# Altium schematic sheet MCU.SchDoc
size A; SheetNumber: 3; SheetTotal: 5
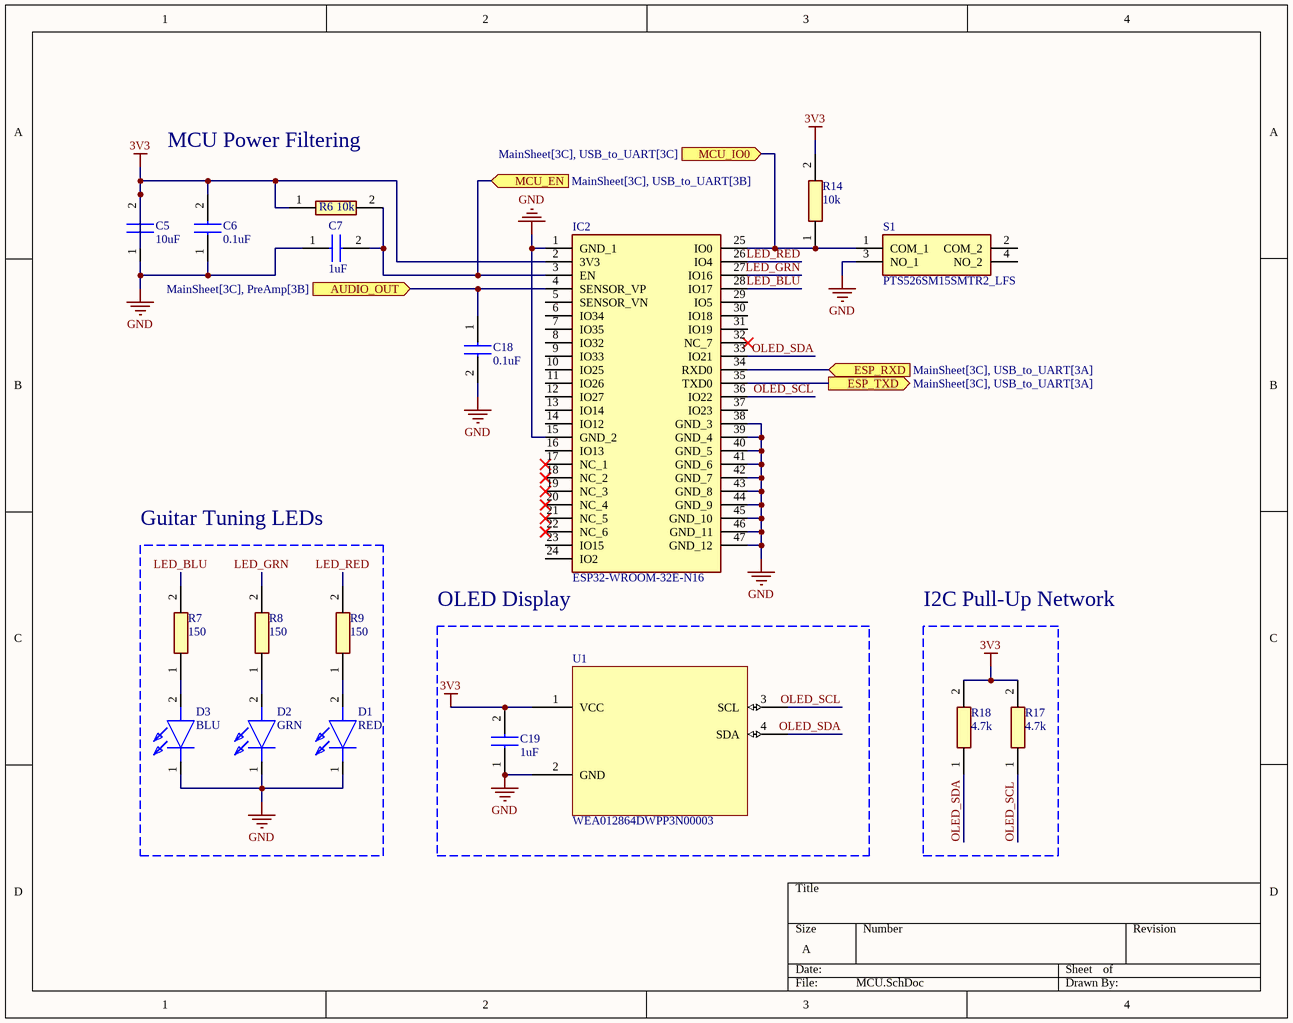
[diagram p0: MCU.SchDoc]

## Parts
C5  10uF  [CAPC2012X140N]
C6  0.1uF  [CAPC2012X88N]
C7  1uF  [CAPC2012X145N]
C18  0.1uF  [CAPC2012X88N]
C19  1uF  [GRM21BR60J226ME39L]
D1  RED  [LEDC2012X85N]
D2  GRN  [LEDC2012X85N]
D3  BLU  [LEDC2012X85N]
IC2  ESP32-WROOM-32E-N16  [ESP32WROOM32EN16]
R6  10k  [ERA6AEB101V]
R7  150  [RESC2012X50N]
R8  150  [RESC2012X50N]
R9  150  [RESC2012X50N]
R14  10k  [ERA6AEB101V]
R17  4.7k  [RESC2012X60N]
R18  4.7k  [RESC2012X60N]
S1  PTS526SM15SMTR2_LFS  [PTS526SM15SMTR2LFS]
U1  WEA012864DWPP3N00003  [OLED_128x64_I2C]

## Blocks framed on the sheet
Guitar Tuning LEDs: D1-D3 R7-R9
OLED Display: C19 U1
I2C Pull-Up Network: R17 R18

## Ports
AUDIO_OUT (in, see MainSheet[3C], PreAmp[3B]), ESP_RXD (in, see MainSheet[3C], USB_to_UART[3A]), ESP_TXD (out, see MainSheet[3C], USB_to_UART[3A]), MCU_EN (in, see MainSheet[3C], USB_to_UART[3B]), MCU_IO0 (in, see MainSheet[3C], USB_to_UART[3C])

## Nets
3V3: C5.2 C6.2 C19.2 IC2.2(3V3) R6.1 R14.2 R17.2 R18.2 U1.1(VCC)
GND: C5.1 C6.1 C7.1 C18.2 C19.1 D1.1(K) D2.1(K) D3.1(K) IC2.1(GND_1) IC2.15(GND_2) IC2.38(GND_3) IC2.39(GND_4) IC2.40(GND_5) IC2.41(GND_6) IC2.42(GND_7) IC2.43(GND_8) IC2.44(GND_9) IC2.45(GND_10) IC2.46(GND_11) IC2.47(GND_12) S1.3(NO_1) U1.2(GND)
AUDIO_OUT: C18.1 IC2.4(SENSOR_VP) ; port AUDIO_OUT
ESP_RXD: IC2.34(RXD0) ; port ESP_RXD
ESP_TXD: IC2.35(TXD0) ; port ESP_TXD
LED_BLU: IC2.28(IO17) R7.2
LED_GRN: IC2.27(IO16) R8.2
LED_RED: IC2.26(IO4) R9.2
MCU_EN: C7.2 IC2.3(EN) R6.2 ; port MCU_EN
MCU_IO0: IC2.25(IO0) R14.1 S1.1(COM_1) ; port MCU_IO0
OLED_SCL: IC2.36(IO22) R17.1 U1.3(SCL)
OLED_SDA: IC2.33(IO21) R18.1 U1.4(SDA)
NetD1_2: D1.2(A) R9.1
NetD2_2: D2.2(A) R8.1
NetD3_2: D3.2(A) R7.1

Not connected (* = marked no-connect by the designer): IC2 5(SENSOR_VN) 6(IO34) 7(IO35) 8(IO32) 9(IO33) 10(IO25) 11(IO26) 12(IO27) 13(IO14) 14(IO12) 16(IO13) 17(NC_1)* 18(NC_2)* 19(NC_3)* 20(NC_4)* 21(NC_5)* 22(NC_6)* 23(IO15) 24(IO2) 29(IO5) 30(IO18) 31(IO19) 32(NC_7)* 37(IO23); S1 2(COM_2) 4(NO_2)

## Notes on the sheet
- MCU Power Filtering

## Library data of the parts
C5 = 10uF Capacitor 0805: Capacitor; Manufacturer_Name: Yageo Group; Manufacturer_Part_Number: C0805C106K8PACTU-2.5; Datasheet Link: https://www.kemet.com/specsheet/C0805C106K8PACTU; Height: 1.4mm; Mouser Part Number: N/A; Mouser Price/Stock: https://www.mouser.com/Search/Refine.aspx?Keyword=N%2FA
C6 C18 = 0.1uF Capacitor 0805: Capacitor; Manufacturer_Name: Yageo Group; Manufacturer_Part_Number: C0805C104K5RAC-TU; Datasheet Link: https://componentsearchengine.com/Datasheets/2/C0805C104K5RAC-TU.pdf; Height: 0.88mm; Arrow Part Number: C0805C104K5RAC-TU; Arrow Price/Stock: https://www.arrow.com/en/products/c0805c104k5ractu/kemet-corporation
C7 = 1uF Capacitor 0805: Capacitor; Manufacturer_Name: Murata Electronics; Manufacturer_Part_Number: GRM21BR71A105KA01L; Datasheet Link: https://search.murata.co.jp/Ceramy/image/img/A01X/G101/ENG/GRM21BR71A105KA01-01A.pdf; Height: 1.45mm; Mouser Part Number: 81-GRM40X105K10L; Mouser Price/Stock: https://www.mouser.co.uk/ProductDetail/Murata-Electronics/GRM21BR71A105KA01L?qs=Rc6BINVvJ%2FjIxBp0DnLtzA%3D%3D; Arrow Part Number: GRM21BR71A105KA01L; Arrow Price/Stock: https://www.arrow.com/en/products/grm21br71a105ka01l/murata-manufacturing
C19 = 1uF Capacitor: Capacitor; Manufacturer_Name: Murata Electronics; Manufacturer_Part_Number: GRM21BR61A105KA01L; Datasheet Link: https://search.murata.co.jp/Ceramy/image/img/A01X/G101/ENG/GRM21BR61A105KA01-01A.pdf; Height: 1.45mm; Mouser Part Number: 81-GRM21R61A105KA01L; Mouser Price/Stock: https://www.mouser.co.uk/ProductDetail/Murata-Electronics/GRM21BR61A105KA01L?qs=E0xLyVzY5mZAKW6GqdeKBA%3D%3D; Arrow Part Number: GRM21BR61A105KA01L; Arrow Price/Stock: https://www.arrow.com/en/products/grm21br61a105ka01l/murata-manufacturing
D1 = Red LED: LED; Manufacturer_Name: Kingbright; Manufacturer_Part_Number: APT2012EC; Datasheet Link: http://www.us.kingbright.com/images/catalog/SPEC/APT2012EC.pdf; Height: 0.85mm; Mouser Part Number: 604-APT2012EC; Mouser Price/Stock: https://www.mouser.co.uk/ProductDetail/Kingbright/APT2012EC?qs=sXafwHSx%252BU%252BiK4iO%2FHnV4A%3D%3D; Arrow Part Number: APT2012EC; Arrow Price/Stock: https://www.arrow.com/en/products/apt2012ec/kingbright?region=nac
D2 = Green LED: LED; Manufacturer_Name: Kingbright; Manufacturer_Part_Number: APT2012SGC; Datasheet Link: http://www.us.kingbright.com/images/catalog/SPEC/APT2012SGC.pdf; Height: 0.85mm; Mouser Part Number: 604-APT2012SGC; Mouser Price/Stock: https://www.mouser.co.uk/ProductDetail/Kingbright/APT2012SGC?qs=SxaZfIVsCL28XycY%2FuxqiQ%3D%3D; Arrow Part Number: APT2012SGC; Arrow Price/Stock: https://www.arrow.com/en/products/apt2012sgc/kingbright?region=nac
D3 = Blue LED: LED; Manufacturer_Name: Kingbright; Manufacturer_Part_Number: APT2012LVBC/D; Datasheet Link: https://componentsearchengine.com/Datasheets/1/APT2012LVBC_D.pdf; Height: 0.85mm; Mouser Part Number: 604-APT2012LVBCD; Mouser Price/Stock: https://www.mouser.co.uk/ProductDetail/Kingbright/APT2012LVBC-D?qs=6oMev5NRZMGErJYT6KZLXg%3D%3D; Arrow Part Number: APT2012LVBC/D; Arrow Price/Stock: https://www.arrow.com/en/products/apt2012lvbcd/kingbright?utm_currency=USD&region=nac
IC2 = ESP32-WROOM-32E-N16: Integrated Circuit; Manufacturer_Name: Espressif Systems; Datasheet Link: https://www.espressif.com/sites/default/files/documentation/esp32-wroom-32e_esp32-wroom-32ue_datasheet_en.pdf; Height: 3.25mm; Manufacturer_Part_Number: ESP32-WROOM-32E-N16; Mouser Part Number: 356-ESP32WRM32E128PH; Mouser Price/Stock: https://www.mouser.co.uk/ProductDetail/Espressif-Systems/ESP32-WROOM-32E-N16?qs=Li%252BoUPsLEnsC4cA%252BUYB2Bw%3D%3D
R6 R14 = 10k Resistor 0805: Resistor; Manufacturer_Name: Panasonic; Manufacturer_Part_Number: ERA-6AED103V; Datasheet Link: https://industrial.panasonic.com/cdbs/www-data/pdf/RDM0000/AOA0000C307.pdf; Height: 0.6mm; Mouser Part Number: 667-ERA-6AED103V; Mouser Price/Stock: https://www.mouser.co.uk/ProductDetail/Panasonic/ERA-6AED103V?qs=MNPzkKEzRtSGdYymydDO9g%3D%3D; Arrow Part Number: ERA-6AED103V; Arrow Price/Stock: https://www.arrow.com/en/products/era-6aed103v/panasonic?region=nac
R7-R9 = 150 Resistor 0805: Resistor; Manufacturer_Name: Vishay; Manufacturer_Part_Number: CRCW0805150RFKEA; Datasheet Link: http://www.vishay.com/docs/20035/dcrcwe3.pdf; Height: 0.5mm; Mouser Part Number: 71-CRCW0805-150-E3; Mouser Price/Stock: https://www.mouser.co.uk/ProductDetail/Vishay-Dale/CRCW0805150RFKEA?qs=bMjB6bAaLEMlCPoDkVBLpg%3D%3D; Arrow Part Number: CRCW0805150RFKEA; Arrow Price/Stock: https://www.arrow.com/en/products/crcw0805150rfkea/vishay?region=nac
R17 R18 = 4.7k Resistor 0805: Resistor; Manufacturer_Name: Yageo Group; Manufacturer_Part_Number: RC0805FR-074K7L; Datasheet Link: http://www.yageo.com/documents/recent/PYu-RC_Group_51_RoHS_L_10.pdf; Height: 0.6mm; Mouser Part Number: 603-RC0805FR-074K7L; Mouser Price/Stock: https://www.mouser.co.uk/ProductDetail/YAGEO/RC0805FR-074K7L?qs=VLOqbHBAO5cYXbrd7RTmuQ%3D%3D; Arrow Part Number: RC0805FR-074K7L; Arrow Price/Stock: https://www.arrow.com/en/products/rc0805fr-074k7l/yageo?utm_currency=USD&region=nac
S1 = PTS526SM15SMTR2_LFS: Switch; Manufacturer_Name: LITTELFUSE; Manufacturer_Part_Number: PTS526SM15SMTR2 LFS; Datasheet Link: https://www.ckswitches.com/media/2780/pts526.pdf; Height: 1.65mm; Mouser Part Number: 611-PTS526SM15SMTR2L; Mouser Price/Stock: https://www.mouser.co.uk/ProductDetail/CK/PTS526SM15SMTR2-LFS?qs=Imq1NPwxi75LpUh6FiCy2w%3D%3D
U1 = WEA012864DWPP3N00003: OLED_128x64_I2C